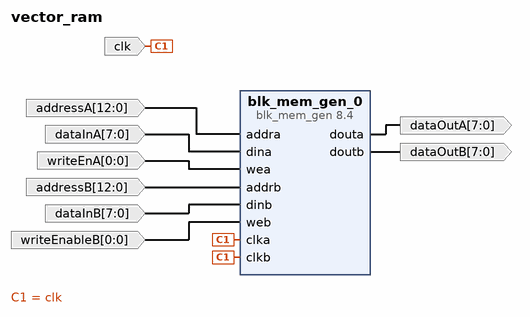
[diagram p0: block diagram of the top level]
# Vivado block design vector_ram, xc7a100tcsg324-1, Vivado 2020.2
create_bd_design vector_ram

create_bd_port -dir I -from 12 -to 0 addressA
create_bd_port -dir I clk
create_bd_port -dir I -from 7 -to 0 dataInA
create_bd_port -dir O -from 7 -to 0 dataOutA
create_bd_port -dir I -from 0 -to 0 writeEnA
create_bd_port -dir I -from 12 -to 0 addressB
create_bd_port -dir I -from 7 -to 0 dataInB
create_bd_port -dir O -from 7 -to 0 dataOutB
create_bd_port -dir I -from 0 -to 0 writeEnableB

create_bd_cell -type ip -vlnv xilinx.com:ip:blk_mem_gen:8.4 blk_mem_gen_0
set_property -dict [list \
  CONFIG.Assume_Synchronous_Clk true \
  CONFIG.Coe_File ../../../../../../../avg_clean2.coe \
  CONFIG.Enable_32bit_Address false \
  CONFIG.Enable_A Always_Enabled \
  CONFIG.Enable_B Always_Enabled \
  CONFIG.Fill_Remaining_Memory_Locations true \
  CONFIG.Load_Init_File true \
  CONFIG.Memory_Type True_Dual_Port_RAM \
  CONFIG.Operating_Mode_A NO_CHANGE \
  CONFIG.Operating_Mode_B READ_FIRST \
  CONFIG.Port_B_Clock 100 \
  CONFIG.Port_B_Enable_Rate 100 \
  CONFIG.Port_B_Write_Rate 50 \
  CONFIG.Read_Width_A 8 \
  CONFIG.Read_Width_B 8 \
  CONFIG.Register_PortA_Output_of_Memory_Primitives true \
  CONFIG.Register_PortB_Output_of_Memory_Primitives true \
  CONFIG.Use_Byte_Write_Enable false \
  CONFIG.Use_RSTA_Pin false \
  CONFIG.Write_Width_A 8 \
  CONFIG.Write_Width_B 8 \
  CONFIG.use_bram_block Stand_Alone \
] [get_bd_cells blk_mem_gen_0]

# ---- connections ----

connect_bd_net [get_bd_ports addressA] [get_bd_pins blk_mem_gen_0/addra]
connect_bd_net [get_bd_ports clk] [get_bd_pins blk_mem_gen_0/clka] [get_bd_pins blk_mem_gen_0/clkb]
connect_bd_net [get_bd_ports dataInA] [get_bd_pins blk_mem_gen_0/dina]
connect_bd_net [get_bd_pins blk_mem_gen_0/douta] [get_bd_ports dataOutA]
connect_bd_net [get_bd_ports writeEnA] [get_bd_pins blk_mem_gen_0/wea]
connect_bd_net [get_bd_ports addressB] [get_bd_pins blk_mem_gen_0/addrb]
connect_bd_net [get_bd_ports dataInB] [get_bd_pins blk_mem_gen_0/dinb]
connect_bd_net [get_bd_pins blk_mem_gen_0/doutb] [get_bd_ports dataOutB]
connect_bd_net [get_bd_ports writeEnableB] [get_bd_pins blk_mem_gen_0/web]

validate_bd_design
save_bd_design
